# Altium schematic sheet Acoustics Board Power.SchDoc: Sample Sheet Title
size B; Date: MM/DD/YYYY; Author: Sample Author; Organization: ORGANIZATION; Address1: ADDRESS 1; Address2: ADDRESS 2; Address3: ADDRESS 3; Address4: ADDRESS 4; Revision: -; SheetNumber: 3; SheetTotal: 5; ENG_APP_DATE: --/--/--; DSN_APP_DATE: --/--/--; CHK_APP_DATE: --/--/--
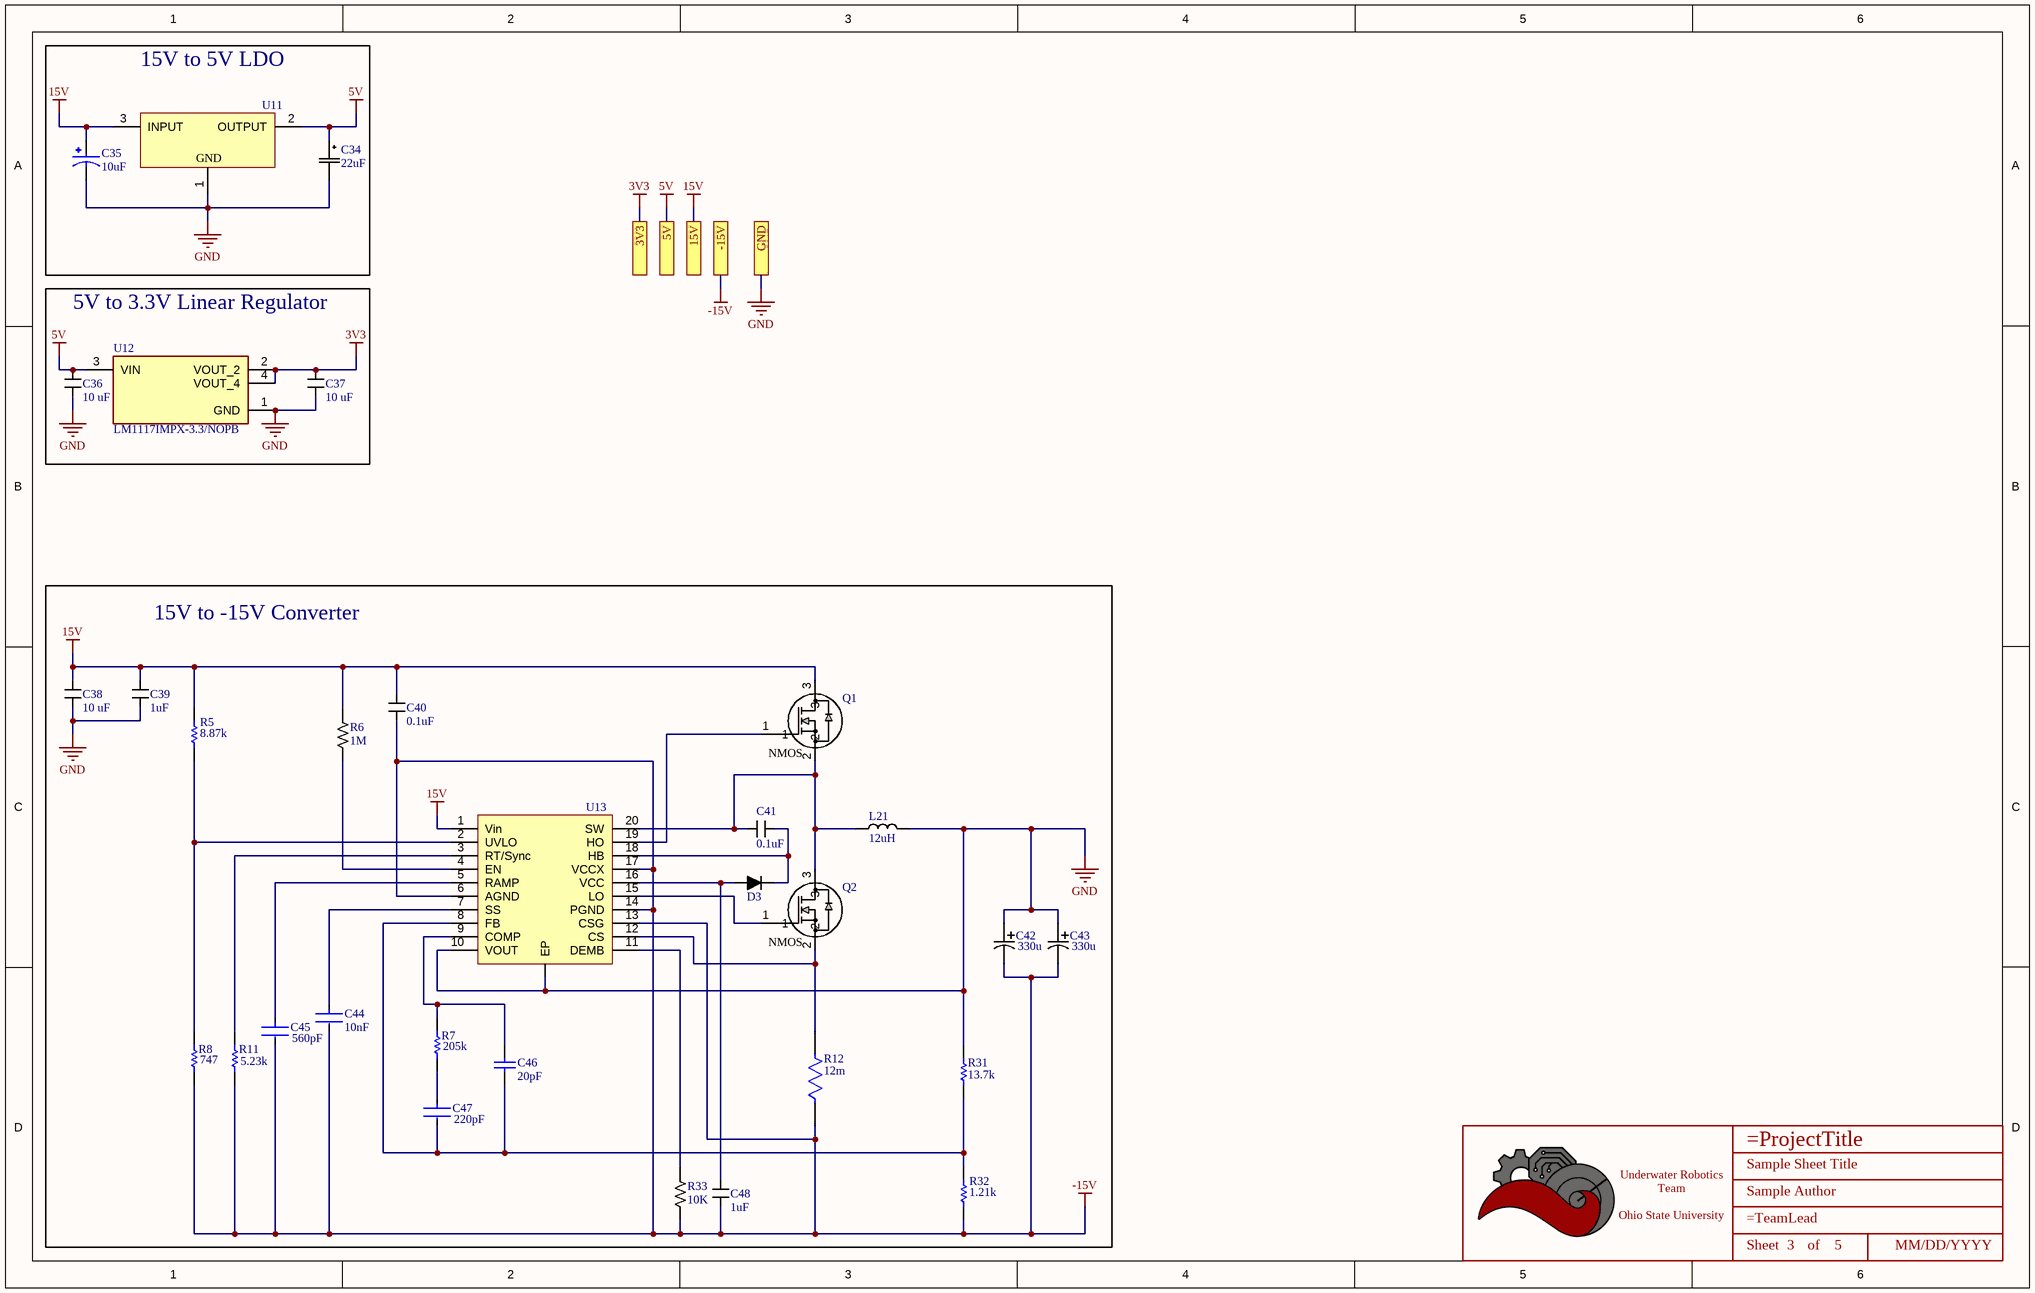
[diagram p0: Acoustics Board Power.SchDoc]

## Parts
*  Title_Block  [LOGO]  (value not drawn)  (graphical)
C34  value 22uF  [PCAP_8x5.4-ELECT_NCA]  (hidden comment: 22uF electrolytic 35 V)
C35  value 10uF  [CAP_EEHZC1J100P]  (hidden comment: 10uF electrolytic 63V)
C36  Value (uF): 10 uF  [CAPACITOR_0603]  (hidden comment: 10uF Ceramic 6.3V)
C37  Value (uF): 10 uF  [CAPACITOR_0603]  (hidden comment: 10uF Ceramic 6.3V)
C38  Value (uF): 10 uF  [CAPACITOR_0603]  (hidden comment: 10uF Ceramic 6.3V)
C39  value 1uF  [CAPACITOR_0402]  (hidden comment: 1uF Ceramic 16V)
C40  value 0.1uF  [CAPACITOR_0402]  (hidden comment: 100nF Ceramic 25V)
C41  value 0.1uF  [CAPACITOR_0402]  (hidden comment: 100nF Ceramic 25V)
C42  Capacitance: 330u  [PCAP_EEHZ_G_PAN]  (hidden comment: EEH-ZC1E331P)
C43  Capacitance: 330u  [PCAP_EEHZ_G_PAN]  (hidden comment: EEH-ZC1E331P)
C44  10nF  [CAPACITOR_0402]
C45  Capacitance: 560pF  [FP-CL10-IPC_C]  (hidden comment: CL10C221JB8NNNC)
C46  Capacitance: 20pF  [CAPC1608X90X30LL10T20]  (hidden comment: CL10C200JB8NNNC)
C47  Capacitance: 220pF  [FP-CL10-IPC_C]  (hidden comment: CL10C221JB8NNNC)
C48  value 1uF  [CAPACITOR_0402]  (hidden comment: 1uF Ceramic 16V)
D3  B330-13-F  [DO-214AB]  (value not drawn)
L21  value 12uH  [INDUCTOR_0603]  (hidden comment: FIXED IND 12UH 10MA 1.8 OHM SMD)
Q1  MOSFET N-Ch 80V 100A D2PAK  [D2PAK]  (value not drawn)
Q2  MOSFET N-Ch 80V 100A D2PAK  [D2PAK]  (value not drawn)
R5  Resistance: 8.87k  [RESC1608X55X25LL10T15]  (hidden comment: RC0603FR-078K87L)
R6  Value  (Ohms): 1M  [RESISTOR_0402]  (hidden comment: 1M Ohm 1% 1/16W)
R7  Resistance: 205k  [RESC1005X40X25ML05T10]  (hidden comment: RC0402FR-07205KL)
R8  Resistance: 747  [RESC1609X50X30NL10T20]  (hidden comment: CRCW0603787RFKEA)
R11  Resistance: 5.23k  [RESC1005X40X25NL05T10]  (hidden comment: RC0402FR-075K23L)
R12  Resistance: 12m  [FP-CSR1206-IPC_B]  (hidden comment: CSR1206FK12L0)
R31  Resistance: 13.7k  [RESC1609X50X30ML10T20]  (hidden comment: CRCW060313K7FKEA)
R32  Resistance: 1.21k  [RESC1608X55X25LL10T15]  (hidden comment: RC0603FR-071K21L)
R33  Value  (Ohms): 10K  [RESISTOR_0603]  (hidden comment: 10k Ohm 0.5% 1/10W)
U11  AZ1117IH-5.0TRG1  [SOT223-3]  (value not drawn)
U12  LM1117IMPX-3.3/NOPB  [SOT-223-4]
U13  LM25116  [LM25116]  (value not drawn)

## Blocks framed on the sheet
15V to 5V LDO: C34 C35 U11
5V to 3.3V Linear Regulator: C36 C37 U12
15V to -15V Converter: C38-C48 D3 L21 Q1 Q2 R5-R8 R11 R12 R31-R33 U13

## Ports
3V3, 5V, 15V, -15V, GND

## Nets
3V3: C37.1 U12.2(VOUT_2) U12.4(VOUT_4) ; port 3V3
5V: C34.1 C36.1 U11.2(OUTPUT) U12.3(VIN) ; port 5V
15V: C35.1 C38.1 C39.1 C40.1 Q1.3 R5.1 R6.1 U11.3(INPUT) U13.1(Vin) ; port 15V
-15V: C40.2 C42.2 C43.2 C44.2 C45.2 C48.2 R8.1 R11.1 R12.1 R32.2 R33.2 U13.6(AGND) U13.13(CSG) U13.14(PGND) U13.17(VCCX) ; port -15V
GND: C34.2 C35.2 C36.2 C37.2 C38.2 C39.2 C42.1 C43.1 L21.1 R31.2 U11.1(GND) U12.1(GND) U13.10(VOUT) U13.21(EP) ; port GND
NetC41_1: C41.1 L21.2 Q1.2 Q2.3 U13.20(SW)
NetC41_2: C41.2 D3.2 U13.18(HB)
NetC44_1: C44.1 U13.7(SS)
NetC45_1: C45.1 U13.5(RAMP)
NetC46_1: C46.1 R7.2 U13.9(COMP)
NetC46_2: C46.2 C47.2 R31.1 R32.1 U13.8(FB)
NetC47_1: C47.1 R7.1
NetC48_1: C48.1 D3.1 U13.16(VCC)
NetQ1_1: Q1.1 U13.19(HO)
NetQ2_1: Q2.1 U13.15(LO)
NetQ2_2: Q2.2 R12.2 U13.12(CS)
NetR5_2: R5.2 R8.2 U13.2(UVLO)
NetR6_2: R6.2 U13.4(EN)
NetR11_2: R11.2 U13.3(RT/Sync)
NetR33_1: R33.1 U13.11(DEMB)

## Notes on the sheet
- DWG. NO.
- REV.
- SHT.
- THIS DOCUMENT AND THE DATA DISCLOSED HEREIN OR HEREWITH IS THE PROPERTY OF ALTIUM LIMITED AND MAY BE FREELY DISTRIBUTED IN WHOLE. NO RIGHTS ARE RESERVED OR EXPRESS OR IMPLIED WARANTEE GIVEN.
- REVISION
- DESCRIPTION
- DATE
- APPROVED
- ENG:
- APPROVALS
- PROJECT
- DSN:
- CHK:
- REFERENCE DOCUMENTS
- PROJECT REVISION:
- TITLE
- DOCUMENT REVISION:
- DESIGN ITEM:
- BOM:
- FAB DWG:
- PCB DWG:
- ASSY DWG:
- SCALE:
- SIZE
- B
- CAGE CODE
- FILE NAME
- DWG NO.
- SHEET
- OF
- REV
- (in symbol PSMN4R4-80BS,118) NMOS
- (in symbol Title_Block) Underwater Robotics Team / Ohio State University; Sheet; of

## Library data of the parts
* = Title_Block: UWRT Schematic Title Block Template / Created June 2021, Dylan Trainor
C34 = CAP ALUM 22UF 20% 35V SMD: 22 µF 35 V Aluminum Electrolytic Capacitors Radial, Can - SMD 1000 Hrs; Made by: Robert Pafford; Voltage: 35V; Supplier 1: Digi-Key; Supplier Part Number 1: PCE3952DKR-ND
C35 = CAP ALUM 10UF 20% 63V SMD: 10 µF 63 V Aluminum - Polymer Capacitors Radial, Can SMD 120mOhm; Made by: Robert Pafford; Tolerance: +/- 20%; Max Voltage: 63V; Supplier 1: Digi-Key; Supplier Part Number 1: P15466CT-ND
C36-C38 = CAPACITOR_10uF_0603: Cap 10uF 6.3V +/-20% / Ceramic 0603; Made By: Flip B; ComponentLink1Description: Digikey; ComponentLink1URL: https://www.digikey.com/en/products/detail/samsung-electro-mechanics/CL10A106MQ8NNNC/3886777; Supplier 1: Digi-Key; Supplier Part Number 1: 1276-1119-1-ND; Tolerance: +/- 20%; Voltage: 6.3V
C39 C48 = CAPACITOR_1uF_0402: Cap 1uF 16V +/-10% / Ceramic 0402; Made By: Robert Pafford; Tolerance: +/- 10%; Voltage: 16V; Supplier 1: Digi-Key; Supplier Part Number 1: 478-0402YD105KAT4ADKR-ND
C40 C41 = CAPACITOR_0.1uF_0402: Cap 100nF 25V +/-10% / Ceramic 0402; Made By: Robert Pafford; Tolerance: +/- 10%; Voltage: 25V; Supplier 1: Digi-Key; Supplier Part Number 1: 478-7868-1-ND
C42 C43 = EEH-ZC1E331P: No Description Available; Mfr_Name: Panasonic; Type: DEV; Copyright: Copyright (C) 2024 Ultra Librarian. All rights reserved.; Manufacturer_Part_Number: EEH-ZC1E331P; RefDes: RefDes
C44 = CAP CER 0.01 UF 0402: CAP CER 10000PF 50V X7R 0402; Manufacturer Part Number: CC0402KRX7R9BB103; Manufacturer: YAGEO; Temperature Coefficient: 30ppm/°C; Material: Ceramic; Automotive Grade: NA; Tolerance: 0.1; Device Class L3: Ceramic Capacitors; Temperature: -55°C to +125°C; Footprint Url: http://www.yageo.com/exep/pages/download/literatures/UPY-C_GEN_24.pdf; Ipc Land Pattern Name: CAPC10050X50; Device Class L1: Passive Components; Automotive: No; Octopart: https://octopart.com/cc0402krx7r9bb103-yageo-8376513; Lead Free: Yes; Temperature Range Low: -55°C; Height: 0.55mm; ComponentLink2URL: http://www.yageo.com/documents/recent/UPY-GP_NP0_16V-to-50V_16.pdf; Capacitance: 10 nF; Category: Cap; ComponentLink2Description: Datasheet; Temperature Range High: +125°C; Digikey Description: CAP CER 10000PF 50V X7R 0402; Voltage Rating: 50 V; Package: CC0402; Device Class L2: Capacitors; Mouser Description: 0402 10 nF 50 V ±10 % Tolerance X7R SMT Multilayer Ceramic Capacitor; Value: 10 nF; RoHS: TRUE; Temperature Characteristic: X7R; Supplier 1: Future Electronics; Supplier Part Number 1: 8570871
C45 C47 = CMP-13271-002543-1: Cap Ceramic 220pF 50V C0G ±5% Pad SMD 0603 +125°C T/R; Temperature Coefficient: 300ppm/°C; Contact Plating: Tin; Voltage Rating (DC): 50V; Case/Package: 0603; Case Code (Metric): 1608; Length: 1.6mm; Depth: 0.8mm; Package Quantity: 1; Lead Free: Lead Free; Mount: Surface Mount; Min Operating Temperature: -55°C; Voltage: 50V; Case Code (Imperial): 0603; Radiation Hardening: No; Max Operating Temperature: 125°C; Material: Ceramic; Dielectric: C0G; Voltage Rating: 50V; Width: 0.031inch; Thickness: 0.035inch; Height: 0.8mm; Packaging: Tape and Reel; Tolerance: 5%
C46 = CMP-2000-06100-1: Chip Capacitor, 20 pF, +/- 5%, 50 V, -55 to 85 degC, 0603 (1608 Metric), RoHS, Tape and Reel; Manufacturer: Samsung Electro-Mechanics; Dielectric: C0G; Rated Voltage: 50V; Tolerance (%): ±5%; Case Size/Dimension: 0603; Datasheet Version: 06/2016; Manufacturer URL: http://www.samsungsem.com/global/index.jsp; Datasheet URL: http://www.samsungsem.com/kr/support/product-search/mlcc/__icsFiles/afieldfile/2016/08/18/S_CL10C200JB8NNNC.pdf; Mounting Technology: SurfaceMount; Package Description: 2-Pin Surface Mount Device, Body 1.60 x 0.80 mm; Package Reference: 0603
D3 = SCHOTTKY_30V_3A: Schottky Diode, 30V reverse breakdown, 3A, Vf = 0.500V; Made By: Tyson N.; Forward Voltage: 500mV; ComponentLink1Description: Datasheet; ComponentLink1URL: https://www.onsemi.com/pdf/datasheet/mbr0520lt1-d.pdf; Forward Current: 3A; Package: DO-214AB; Supplier 1: RSComponents; Supplier Part Number 1: 7513269
L21 = INDUCTOR_12uH_0603: 12 µH Shielded Multilayer Inductor 10 mA 1.8Ohm Max 0603 (1608 Metric); Tolerance: +/- 20%; Made By: Robert Pafford; DC Resistance: 36mOhm; Current Rating: 2.1A; Supplier 1: Arrow Electronics; Supplier Part Number 1: MLF1608E120JTD25
Q1 Q2 = PSMN4R4-80BS,118: N-Channel 80V 100A (Ta) 306W (Ta), Surface Mount D2PAK; Vendor: Nexperia USA Inc.; Vgs (Max): +/- 20 V; Vgs (th): 3V; Rds (on): 3.8mOhm @ 25A, 10Vgs; Amp Rating: 100A; FET Type: N-Channel; Package: D2PAK; Manufacturer _Part_Number: PSMN4R4-80BS,118; Vdss: 80 V; Power Dissipation: 306W; Created By: Flip B; Supplier 1: Digi-Key; Supplier Part Number 1: 1727-7123-1-ND
R5 = CMP-2000-03933-1: Manufacturer: Yageo; Part Number: RC0603FR-071K21L
R6 = RESISTOR_1M_0402: RES 1M OHM 1% 1/16W 0402; Tolerance: +/- 1%; Made By: Robert Pafford; Wattage: 1/16W; Supplier 1: Digikey; Supplier Part Number 1: YAG3450CT-ND
R7 = CMP-1011-00769-2: Manufacturer: Yageo / Phycomp; Part Number: RC0402FR-07205KL
R8 = CMP-2000-03578-1: Manufacturer: Vishay Dale; Part Number: CRCW0603787RFKEA
R11 = CMP-2002-06960-1: Manufacturer: Yageo; Part Number: RC0402FR-075K23L
R12 = CMP-26527-002803-1: General Purpose Thick Film Chip Resistor, 1206, 12mΩ, 1%, 0.5W; Temperature Coefficient: 100ppm/°C; Max Power Dissipation: 500mW; Case/Package: 1206; Case Code (Imperial): 1206; Series: CSR; Max Operating Temperature: 155°C; Contact Plating: Tin; Min Operating Temperature: -55°C; Length: 0.12inch; Tolerance: 1%; Width: 0.061inch; Packaging: Tape and Reel; Military Standard: Not; Lead Free: Lead Free; Construction: Rectangular; Depth: 1.55mm; Mount: Surface Mount; RoHS Compliant: Yes; Case Code (Metric): 3216; Resistor Type: Thick Film; Number of Terminations: 2; Height: 0.026inch
R31 = CMP-2000-03899-1: Manufacturer: Vishay Dale; Part Number: CRCW060313K7FKEA
R32 = CMP-2000-03933-1: Manufacturer: Yageo; Part Number: RC0603FR-071K21L
R33 = RESISTOR_10K_0.5%_0603: RES 10k OHM 0.5% 1/10W 0603; Tolerance: +/- 0.5%; Made By: Robert Pafford; Wattage: 1/10W; Supplier: Digikey; Digikey Part Numer: CR0603-JW-104ELFTR-ND; Supplier 1: Digi-Key; Supplier Part Number 1: 749-1695-1-ND
U11 = AZ1117IH-5.0TRG1: Linear Voltage Regulator IC Positive Fixed 1 Output 1A SOT-223-3
U12 = LM1117IMPX-3.3/NOPB: 800-mA 15-V linear voltage regulator 4-SOT-223 -40 to 125; MF: Texas Instruments; Texas_Instruments-Purchase-URL: https://snapeda.com/shop?store=Texas+Instruments&id=410186; Price: None; Mouser-Purchase-URL: https://snapeda.com/shop?store=Mouser&id=410186; MP: LM1117IMPX-3.3/NOPB; Value: *; Availability: Good; Package: SOT-223-4 Texas Instruments; Arrow_Electronics-Purchase-URL: https://snapeda.com/shop?store=Arrow+Electronics&id=410186; SnapEDA_Link: https://www.snapeda.com/parts/LM1117IMPX-3.3/NOPB/Texas%20Instruments/view-part/410186/?ref=snap; DigiKey-Purchase-URL: https://snapeda.com/shop?store=DigiKey&id=410186
U13 = LM25116: IC REG CTRLR BUCK 20TSSOP